# Altium project 4-in-1 ESC based on AM32.PrjPcb
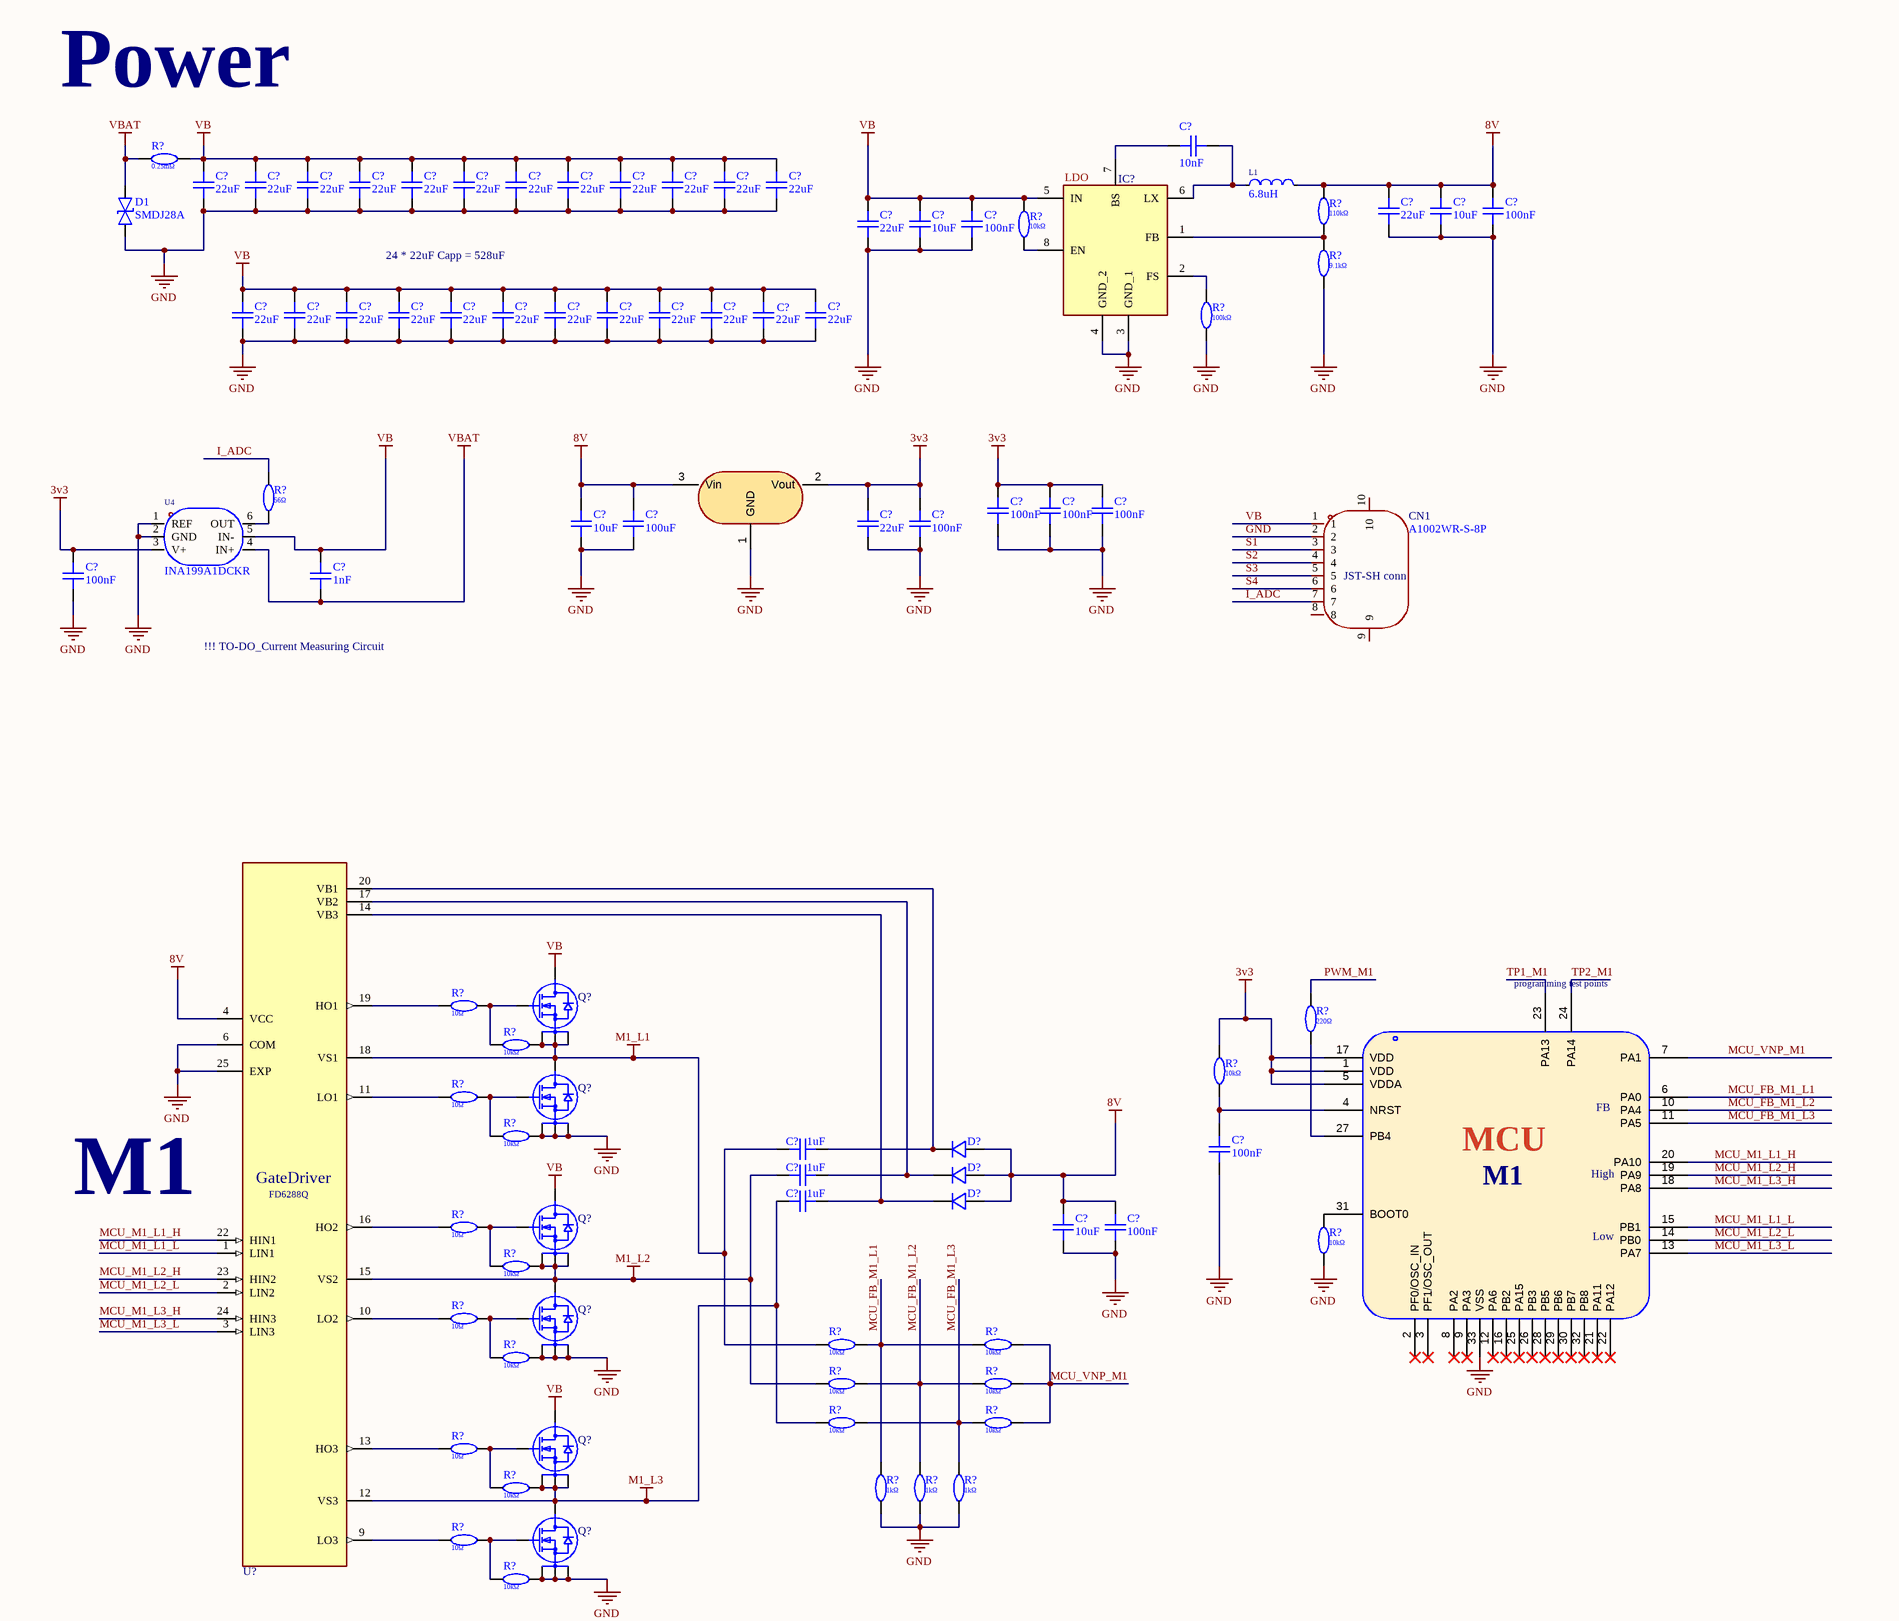
[diagram p0: 4-in-1 ESC based on AM32.SchDoc, top left]
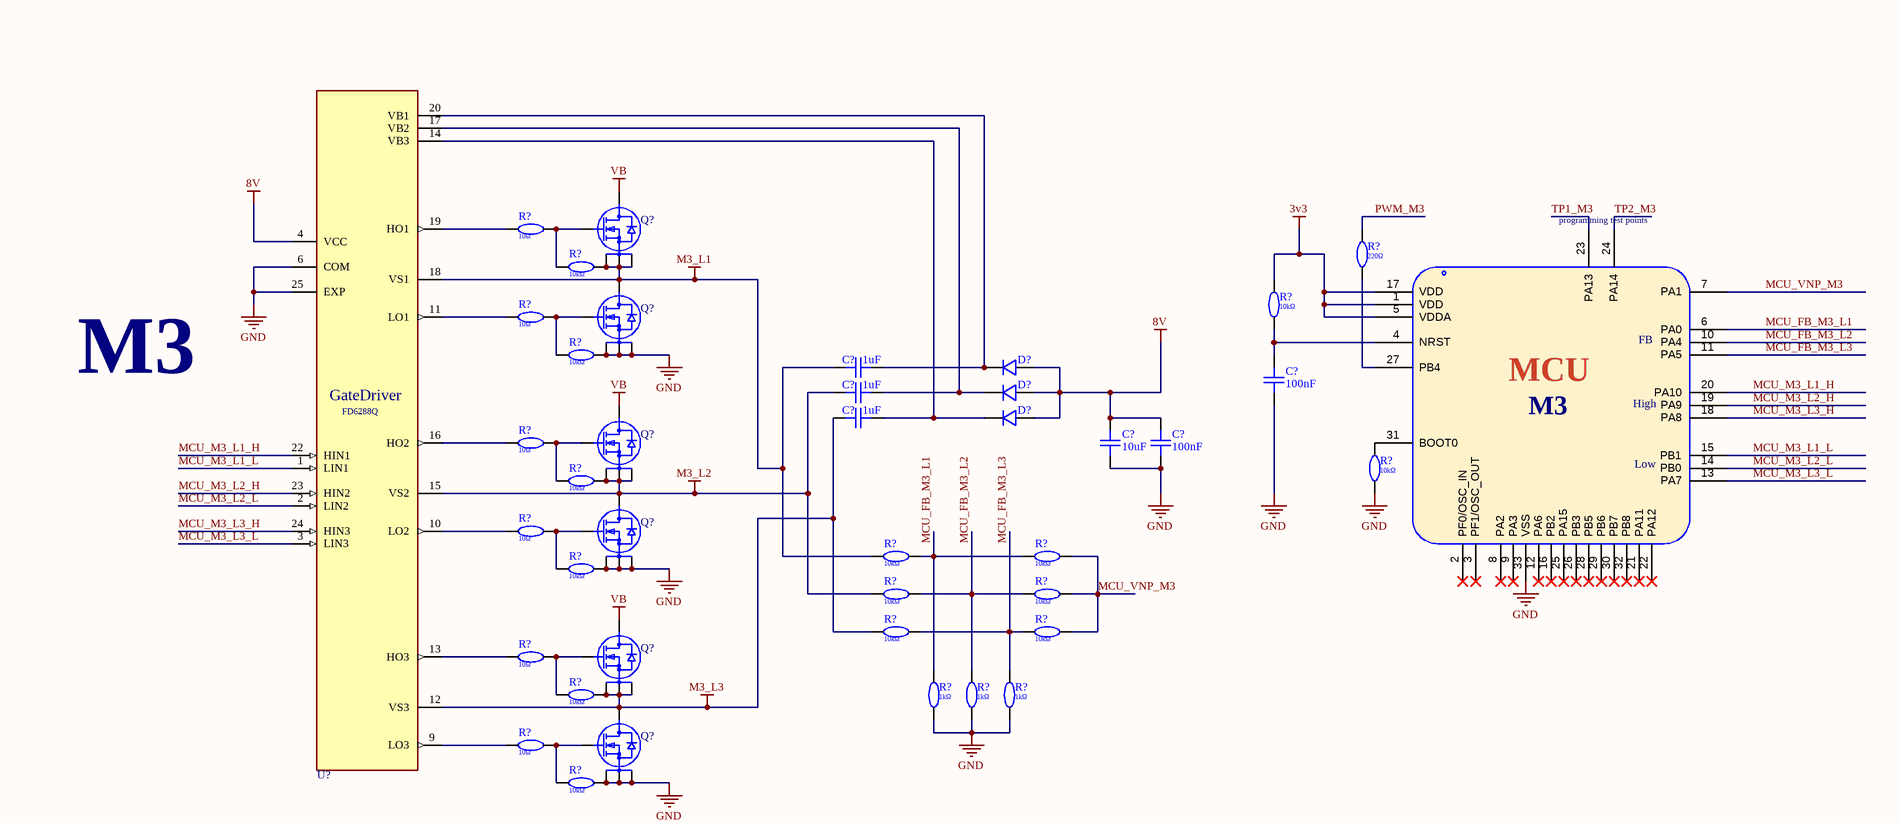
[diagram p1: 4-in-1 ESC based on AM32.SchDoc, top right]
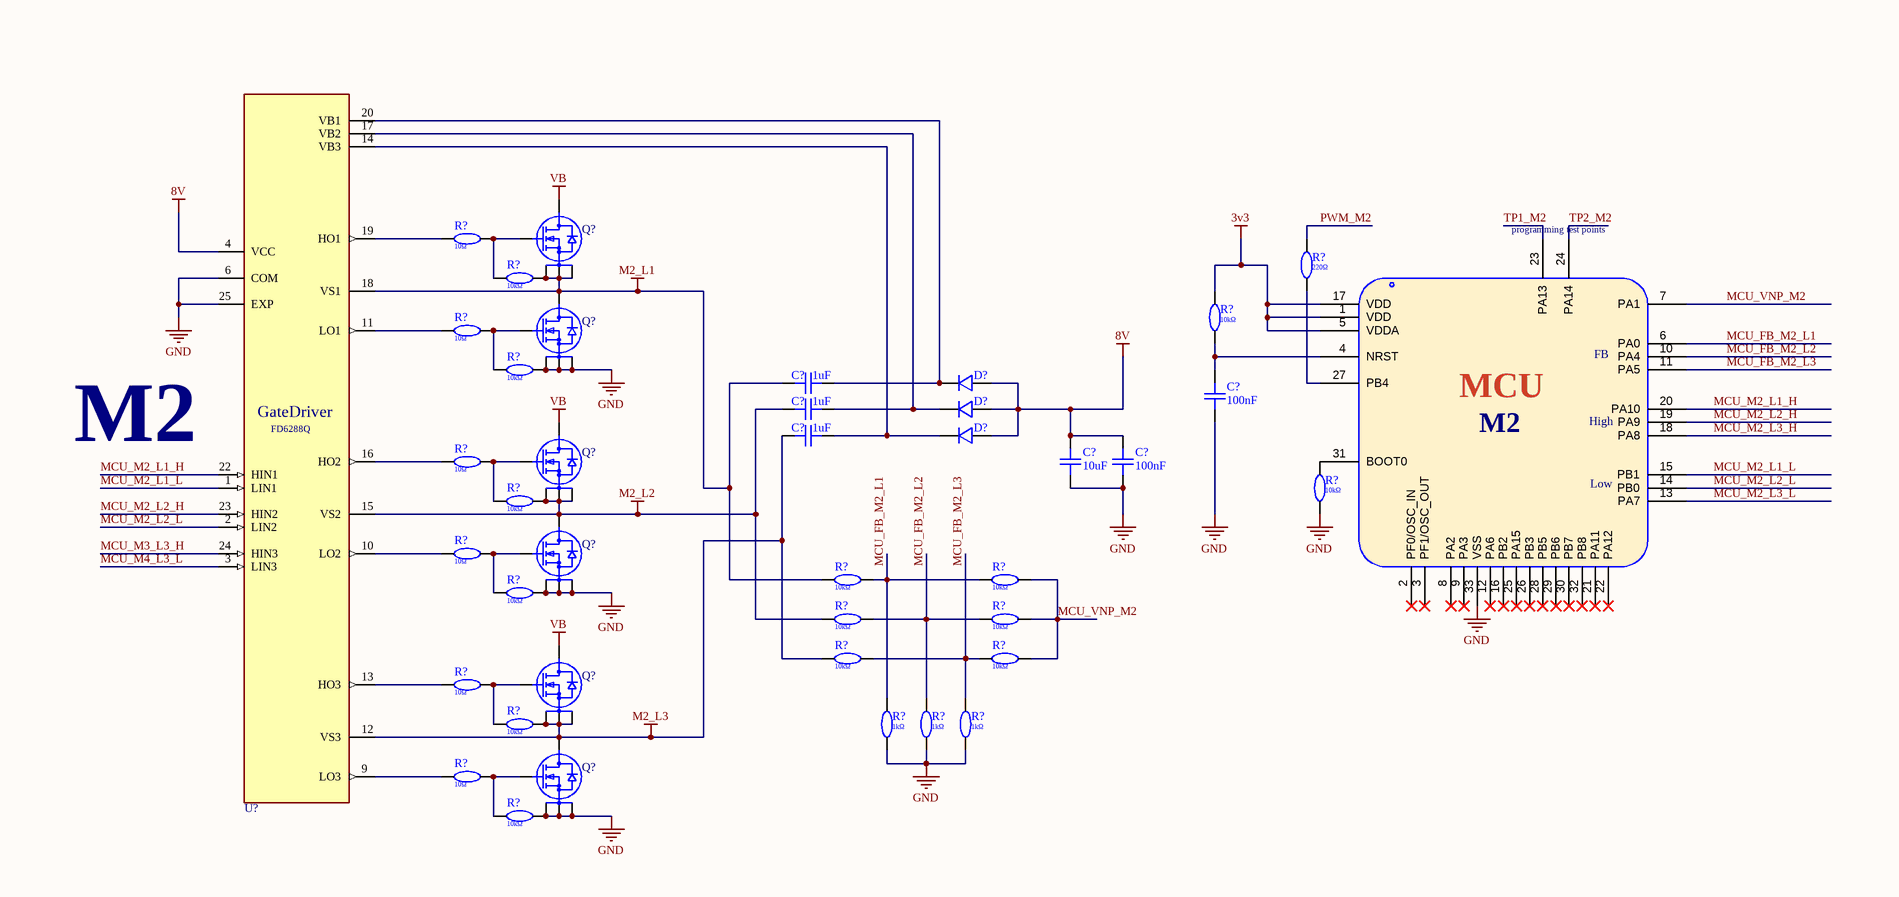
[diagram p2: 4-in-1 ESC based on AM32.SchDoc, bottom left]
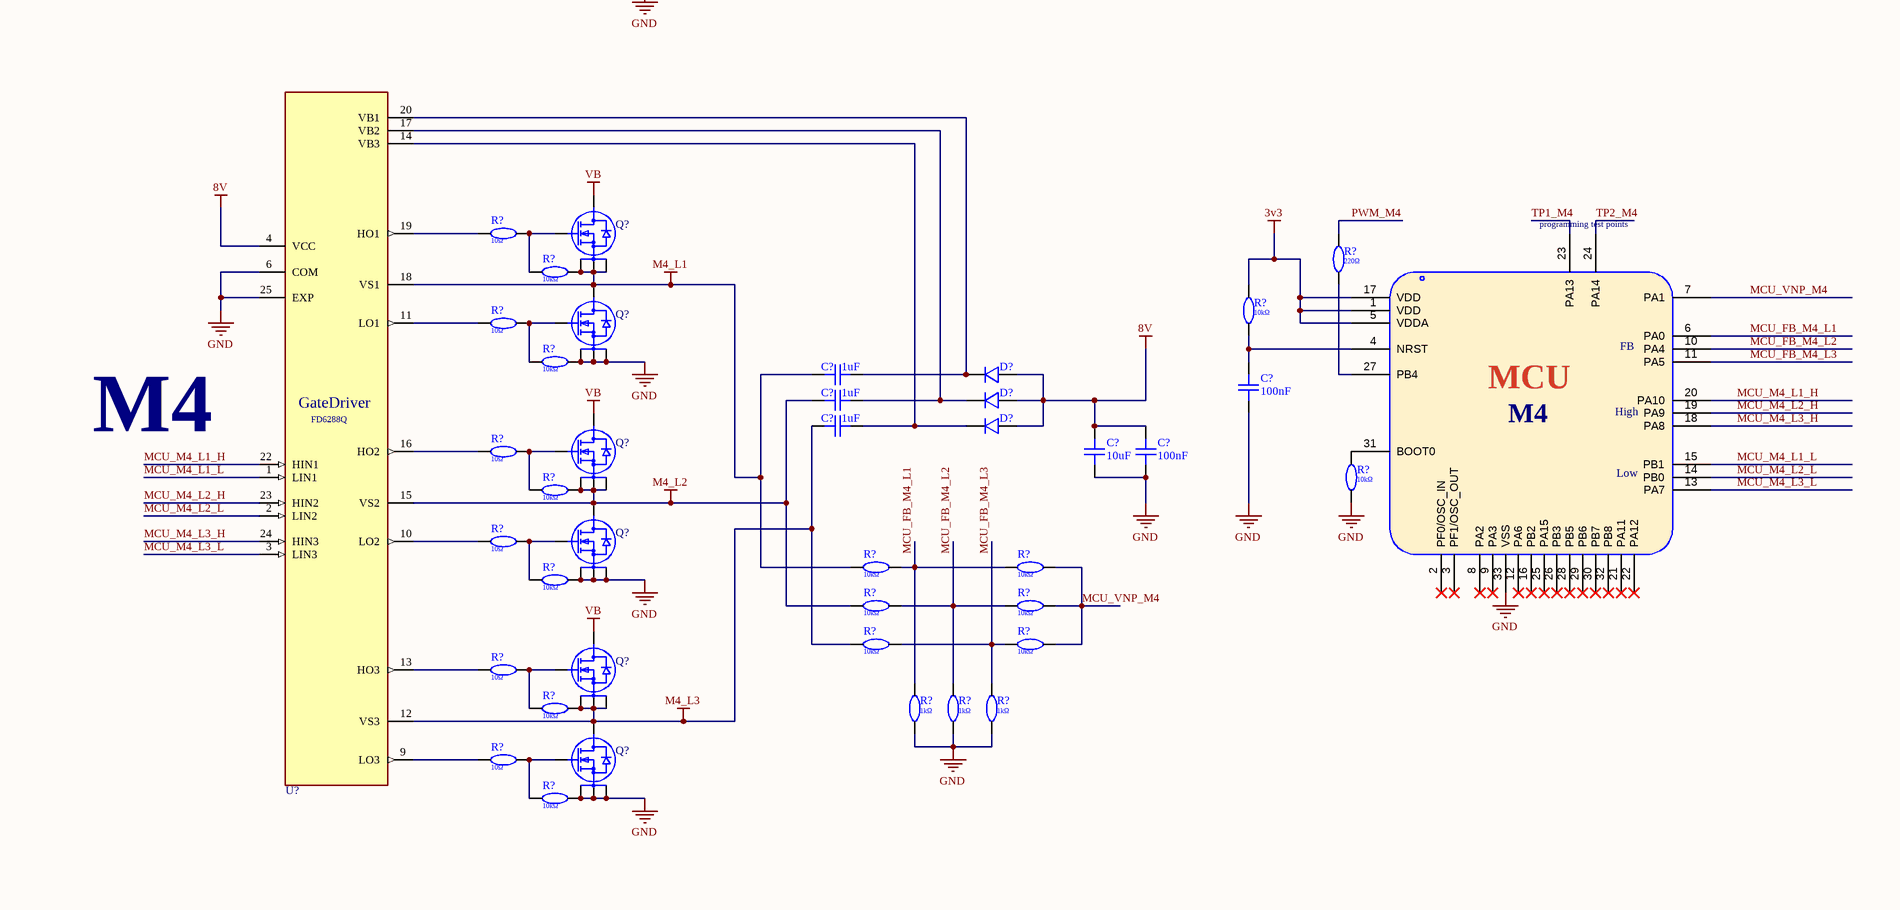
[diagram p3: 4-in-1 ESC based on AM32.SchDoc, bottom right]
1 sheet, 216 parts. Net scope: global (net labels, ports and power ports of the same name join across sheets).
Board file: 4-in-1 ESC based on AM32.PcbDoc

## Sheet 4-in-1 ESC based on AM32.SchDoc
size 812 x 558 mm; SheetNumber: 1; SheetTotal: 1

### Parts
(Parts that share a designator on the sheet are numbered #1, #2 ... from top to bottom, then left to right.)
C?#1  10nF  [C0402]
C?#2  22uF  [C0402]
C?#3  22uF  [C0402]
C?#4  22uF  [C0402]
C?#5  22uF  [C0402]
C?#6  22uF  [C0402]
C?#7  22uF  [C0402]
C?#8  22uF  [C0402]
C?#9  22uF  [C0402]
C?#10  22uF  [C0402]
C?#11  22uF  [C0402]
C?#12  22uF  [C0402]
C?#13  22uF  [C0402]
C?#14  22uF  [C0402]
C?#15  10uF  [C0402]
C?#16  100nF  [C0402]
C?#17  22uF  [C0402]
C?#18  10uF  [C0402]
C?#19  100nF  [C0402]
C?#20  22uF  [C0402]
C?#21  22uF  [C0402]
C?#22  22uF  [C0402]
C?#23  22uF  [C0402]
C?#24  22uF  [C0402]
C?#25  22uF  [C0402]
C?#26  22uF  [C0402]
C?#27  22uF  [C0402]
C?#28  22uF  [C0402]
C?#29  22uF  [C0402]
C?#30  22uF  [C0402]
C?#31  22uF  [C0402]
C?#32  100nF  [C0402]
C?#33  100nF  [C0402]
C?#34  100nF  [C0402]
C?#35  10uF  [C0402]
C?#36  100uF  [C0402]
C?#37  22uF  [C0402]
C?#38  100nF  [C0402]
C?#39  100nF  [C0402]
C?#40  1nF  [C0402]
C?#41  1uF  [C0402]
C?#42  100nF  [C0402]
C?#43  1uF  [C0402]
C?#44  1uF  [C0402]
C?#45  100nF  [C0402]
C?#46  1uF  [C0402]
C?#47  1uF  [C0402]
C?#48  1uF  [C0402]
C?#49  10uF  [C0402]
C?#50  100nF  [C0402]
C?#51  10uF  [C0402]
C?#52  100nF  [C0402]
C?#53  1uF  [C0402]
C?#54  100nF  [C0402]
C?#55  1uF  [C0402]
C?#56  1uF  [C0402]
C?#57  100nF  [C0402]
C?#58  1uF  [C0402]
C?#59  1uF  [C0402]
C?#60  10uF  [C0402]
C?#61  100nF  [C0402]
C?#62  1uF  [C0402]
C?#63  10uF  [C0402]
C?#64  100nF  [C0402]
CN1  A1002WR-S-8P  [CONN-SMD_A1002WR-S-8P]
D1  SMDJ28A  [SMC_L6.9-W5.9-LS7.9-BI]
D?#1  1N4148WTQ-7  [SOD-523_L1.2-W0.8-LS1.6-FD]  (value not drawn)
D?#2  1N4148WTQ-7  [SOD-523_L1.2-W0.8-LS1.6-FD]  (value not drawn)
D?#3  1N4148WTQ-7  [SOD-523_L1.2-W0.8-LS1.6-FD]  (value not drawn)
D?#4  1N4148WTQ-7  [SOD-523_L1.2-W0.8-LS1.6-FD]  (value not drawn)
D?#5  1N4148WTQ-7  [SOD-523_L1.2-W0.8-LS1.6-FD]  (value not drawn)
D?#6  1N4148WTQ-7  [SOD-523_L1.2-W0.8-LS1.6-FD]  (value not drawn)
D?#7  1N4148WTQ-7  [SOD-523_L1.2-W0.8-LS1.6-FD]  (value not drawn)
D?#8  1N4148WTQ-7  [SOD-523_L1.2-W0.8-LS1.6-FD]  (value not drawn)
D?#9  1N4148WTQ-7  [SOD-523_L1.2-W0.8-LS1.6-FD]  (value not drawn)
D?#10  1N4148WTQ-7  [SOD-523_L1.2-W0.8-LS1.6-FD]  (value not drawn)
D?#11  1N4148WTQ-7  [SOD-523_L1.2-W0.8-LS1.6-FD]  (value not drawn)
D?#12  1N4148WTQ-7  [SOD-523_L1.2-W0.8-LS1.6-FD]  (value not drawn)
IC?  LDO_SY8303AIC  [SOT65P280X110-8N]  (value not drawn)
L1  6.8uH  [IND-SMD_L4.4-W4.2]
Q?#1  NTMFS5C430NLT1G  [NRVTS10100EMFST1G]  (value not drawn)
Q?#2  NTMFS5C430NLT1G  [NRVTS10100EMFST1G]  (value not drawn)
Q?#3  NTMFS5C430NLT1G  [NRVTS10100EMFST1G]  (value not drawn)
Q?#4  NTMFS5C430NLT1G  [NRVTS10100EMFST1G]  (value not drawn)
Q?#5  NTMFS5C430NLT1G  [NRVTS10100EMFST1G]  (value not drawn)
Q?#6  NTMFS5C430NLT1G  [NRVTS10100EMFST1G]  (value not drawn)
Q?#7  NTMFS5C430NLT1G  [NRVTS10100EMFST1G]  (value not drawn)
Q?#8  NTMFS5C430NLT1G  [NRVTS10100EMFST1G]  (value not drawn)
Q?#9  NTMFS5C430NLT1G  [NRVTS10100EMFST1G]  (value not drawn)
Q?#10  NTMFS5C430NLT1G  [NRVTS10100EMFST1G]  (value not drawn)
Q?#11  NTMFS5C430NLT1G  [NRVTS10100EMFST1G]  (value not drawn)
Q?#12  NTMFS5C430NLT1G  [NRVTS10100EMFST1G]  (value not drawn)
Q?#13  NTMFS5C430NLT1G  [NRVTS10100EMFST1G]  (value not drawn)
Q?#14  NTMFS5C430NLT1G  [NRVTS10100EMFST1G]  (value not drawn)
Q?#15  NTMFS5C430NLT1G  [NRVTS10100EMFST1G]  (value not drawn)
Q?#16  NTMFS5C430NLT1G  [NRVTS10100EMFST1G]  (value not drawn)
Q?#17  NTMFS5C430NLT1G  [NRVTS10100EMFST1G]  (value not drawn)
Q?#18  NTMFS5C430NLT1G  [NRVTS10100EMFST1G]  (value not drawn)
Q?#19  NTMFS5C430NLT1G  [NRVTS10100EMFST1G]  (value not drawn)
Q?#20  NTMFS5C430NLT1G  [NRVTS10100EMFST1G]  (value not drawn)
Q?#21  NTMFS5C430NLT1G  [NRVTS10100EMFST1G]  (value not drawn)
Q?#22  NTMFS5C430NLT1G  [NRVTS10100EMFST1G]  (value not drawn)
Q?#23  NTMFS5C430NLT1G  [NRVTS10100EMFST1G]  (value not drawn)
Q?#24  NTMFS5C430NLT1G  [NRVTS10100EMFST1G]  (value not drawn)
R?#1  0.25mΩ  [R0402]
R?#2  110kΩ  [R0402]
R?#3  10kΩ  [R0402]
R?#4  9.1kΩ  [R0402]
R?#5  100kΩ  [R0402]
R?#6  56Ω  [R0402]
R?#7  10Ω  [R0402]
R?#8  220Ω  [R0402]
R?#9  10Ω  [R0402]
R?#10  10kΩ  [R0402]
R?#11  220Ω  [R0402]
R?#12  10kΩ  [R0402]
R?#13  10kΩ  [R0402]
R?#14  10Ω  [R0402]
R?#15  10kΩ  [R0402]
R?#16  10Ω  [R0402]
R?#17  10kΩ  [R0402]
R?#18  10kΩ  [R0402]
R?#19  10Ω  [R0402]
R?#20  10kΩ  [R0402]
R?#21  10Ω  [R0402]
R?#22  10kΩ  [R0402]
R?#23  10kΩ  [R0402]
R?#24  10kΩ  [R0402]
R?#25  10Ω  [R0402]
R?#26  10Ω  [R0402]
R?#27  10kΩ  [R0402]
R?#28  10kΩ  [R0402]
R?#29  10kΩ  [R0402]
R?#30  10kΩ  [R0402]
R?#31  10kΩ  [R0402]
R?#32  10kΩ  [R0402]
R?#33  10kΩ  [R0402]
R?#34  10kΩ  [R0402]
R?#35  10kΩ  [R0402]
R?#36  10kΩ  [R0402]
R?#37  10kΩ  [R0402]
R?#38  10kΩ  [R0402]
R?#39  10kΩ  [R0402]
R?#40  10kΩ  [R0402]
R?#41  10Ω  [R0402]
R?#42  10Ω  [R0402]
R?#43  10kΩ  [R0402]
R?#44  1kΩ  [R0402]
R?#45  1kΩ  [R0402]
R?#46  1kΩ  [R0402]
R?#47  10kΩ  [R0402]
R?#48  1kΩ  [R0402]
R?#49  1kΩ  [R0402]
R?#50  1kΩ  [R0402]
R?#51  10Ω  [R0402]
R?#52  10Ω  [R0402]
R?#53  10kΩ  [R0402]
R?#54  10kΩ  [R0402]
R?#55  10Ω  [R0402]
R?#56  220Ω  [R0402]
R?#57  10Ω  [R0402]
R?#58  10kΩ  [R0402]
R?#59  220Ω  [R0402]
R?#60  10kΩ  [R0402]
R?#61  10kΩ  [R0402]
R?#62  10Ω  [R0402]
R?#63  10kΩ  [R0402]
R?#64  10Ω  [R0402]
R?#65  10kΩ  [R0402]
R?#66  10kΩ  [R0402]
R?#67  10Ω  [R0402]
R?#68  10kΩ  [R0402]
R?#69  10Ω  [R0402]
R?#70  10kΩ  [R0402]
R?#71  10kΩ  [R0402]
R?#72  10kΩ  [R0402]
R?#73  10Ω  [R0402]
R?#74  10kΩ  [R0402]
R?#75  10kΩ  [R0402]
R?#76  10Ω  [R0402]
R?#77  10kΩ  [R0402]
R?#78  10kΩ  [R0402]
R?#79  10kΩ  [R0402]
R?#80  10kΩ  [R0402]
R?#81  10kΩ  [R0402]
R?#82  10kΩ  [R0402]
R?#83  10kΩ  [R0402]
R?#84  10kΩ  [R0402]
R?#85  10kΩ  [R0402]
R?#86  10kΩ  [R0402]
R?#87  10Ω  [R0402]
R?#88  10kΩ  [R0402]
R?#89  10kΩ  [R0402]
R?#90  10Ω  [R0402]
R?#91  10kΩ  [R0402]
R?#92  1kΩ  [R0402]
R?#93  1kΩ  [R0402]
R?#94  1kΩ  [R0402]
R?#95  10kΩ  [R0402]
R?#96  1kΩ  [R0402]
R?#97  1kΩ  [R0402]
R?#98  1kΩ  [R0402]
R?#99  10Ω  [R0402]
R?#100  10Ω  [R0402]
R?#101  10kΩ  [R0402]
R?#102  10kΩ  [R0402]
U4  INA199A1DCKR  [SC-70-6_L2.2-W1.3-P0.65-LS2.1-BR]
U?#1  cja1117b-3.3  [SOT-89-3_L4.5-W2.5-P1.50-LS4.2-BR]  (value not drawn)
U?#2  at32f421k8u7  [QFN-32_L5.0-W5.0-P0.50-BL-EP3.4]  (value not drawn)
U?#3  at32f421k8u7  [QFN-32_L5.0-W5.0-P0.50-BL-EP3.4]  (value not drawn)
U?#4  FD6288Q  [QFN50P400X400X90-25N]  (value not drawn)
U?#5  FD6288Q  [QFN50P400X400X90-25N]  (value not drawn)
U?#6  at32f421k8u7  [QFN-32_L5.0-W5.0-P0.50-BL-EP3.4]  (value not drawn)
U?#7  at32f421k8u7  [QFN-32_L5.0-W5.0-P0.50-BL-EP3.4]  (value not drawn)
U?#8  FD6288Q  [QFN50P400X400X90-25N]  (value not drawn)
U?#9  FD6288Q  [QFN50P400X400X90-25N]  (value not drawn)

### Nets
3v3: C?#32.2 C?#33.2 C?#34.2 C?#37.2 C?#38.2 C?#39.2 R?#13.1 R?#15.1 R?#61.1 R?#63.1 U4.3(V+) U?#1.2(Vout) U?#2.1(VDD) U?#2.5(VDDA) U?#2.17(VDD) U?#3.1(VDD) U?#3.5(VDDA) U?#3.17(VDD) U?#6.1(VDD) U?#6.5(VDDA) U?#6.17(VDD) U?#7.1(VDD) U?#7.5(VDDA) U?#7.17(VDD)
8V: C?#14.2 C?#15.2 C?#16.2 C?#35.2 C?#36.2 C?#49.2 C?#50.2 C?#51.2 C?#52.2 C?#60.2 C?#61.2 C?#63.2 C?#64.2 D?#1.1 D?#2.1 D?#3.1 D?#4.1 D?#5.1 D?#6.1 D?#7.1 D?#8.1 D?#9.1 D?#10.1 D?#11.1 D?#12.1 L1.2 R?#2.1 U?#1.3(Vin) U?#4.4(VCC) U?#5.4(VCC) U?#8.4(VCC) U?#9.4(VCC)
GND: C?#2.1 C?#3.1 C?#4.1 C?#5.1 C?#6.1 C?#7.1 C?#8.1 C?#9.1 C?#10.1 C?#11.1 C?#12.1 C?#13.1 C?#14.1 C?#15.1 C?#16.1 C?#17.1 C?#18.1 C?#19.1 C?#20.1 C?#21.1 C?#22.1 C?#23.1 C?#24.1 C?#25.1 C?#26.1 C?#27.1 C?#28.1 C?#29.1 C?#30.1 C?#31.1 C?#32.1 C?#33.1 C?#34.1 C?#35.1 C?#36.1 C?#37.1 C?#38.1 C?#39.1 C?#42.1 C?#45.1 C?#49.1 C?#50.1 C?#51.1 C?#52.1 C?#54.1 C?#57.1 C?#60.1 C?#61.1 C?#63.1 C?#64.1 CN1.2 D1.1 IC?.3(GND_1) IC?.4(GND_2) Q?#3.1(S_1) Q?#3.2(S_2) Q?#3.3(S_3) Q?#4.1(S_1) Q?#4.2(S_2) Q?#4.3(S_3) Q?#7.1(S_1) Q?#7.2(S_2) Q?#7.3(S_3) Q?#8.1(S_1) Q?#8.2(S_2) Q?#8.3(S_3) Q?#11.1(S_1) Q?#11.2(S_2) Q?#11.3(S_3) Q?#12.1(S_1) Q?#12.2(S_2) Q?#12.3(S_3) Q?#15.1(S_1) Q?#15.2(S_2) Q?#15.3(S_3) Q?#16.1(S_1) Q?#16.2(S_2) Q?#16.3(S_3) Q?#19.1(S_1) Q?#19.2(S_2) Q?#19.3(S_3) Q?#20.1(S_1) Q?#20.2(S_2) Q?#20.3(S_3) Q?#23.1(S_1) Q?#23.2(S_2) Q?#23.3(S_3) Q?#24.1(S_1) Q?#24.2(S_2) Q?#24.3(S_3) R?#4.2 R?#5.2 R?#17.1 R?#18.1 R?#20.1 R?#23.1 R?#29.1 R?#32.1 R?#44.2 R?#45.2 R?#46.2 R?#48.2 R?#49.2 R?#50.2 R?#53.1 R?#54.1 R?#65.1 R?#66.1 R?#68.1 R?#71.1 R?#77.1 R?#82.1 R?#92.2 R?#93.2 R?#94.2 R?#96.2 R?#97.2 R?#98.2 R?#101.1 R?#102.1 U4.1(REF) U4.2(GND) U?#1.1(GND) U?#2.33(VSS) U?#3.33(VSS) U?#4.6(COM) U?#4.25(EXP) U?#5.6(COM) U?#5.25(EXP) U?#6.33(VSS) U?#7.33(VSS) U?#8.6(COM) U?#8.25(EXP) U?#9.6(COM) U?#9.25(EXP)
M1_L1: C?#41.1 Q?#1.1(S_1) Q?#1.2(S_2) Q?#1.3(S_3) Q?#3.5(D) R?#10.1 R?#27.2 U?#4.18(VS1)
M1_L2: C?#44.1 Q?#5.1(S_1) Q?#5.2(S_2) Q?#5.3(S_3) Q?#7.5(D) R?#22.1 R?#33.2 U?#4.15(VS2)
M1_L3: C?#47.1 Q?#9.1(S_1) Q?#9.2(S_2) Q?#9.3(S_3) Q?#11.5(D) R?#37.2 R?#43.1 U?#4.12(VS3)
M2_L1: C?#56.1 Q?#14.1(S_1) Q?#14.2(S_2) Q?#14.3(S_3) Q?#16.5(D) R?#60.1 R?#78.2 U?#9.18(VS1)
M2_L2: C?#59.1 Q?#18.1(S_1) Q?#18.2(S_2) Q?#18.3(S_3) Q?#20.5(D) R?#72.1 R?#83.2 U?#9.15(VS2)
M2_L3: C?#62.1 Q?#22.1(S_1) Q?#22.2(S_2) Q?#22.3(S_3) Q?#24.5(D) R?#88.2 R?#95.1 U?#9.12(VS3)
M3_L1: C?#43.1 Q?#2.1(S_1) Q?#2.2(S_2) Q?#2.3(S_3) Q?#4.5(D) R?#12.1 R?#30.2 U?#5.18(VS1)
M3_L2: C?#46.1 Q?#6.1(S_1) Q?#6.2(S_2) Q?#6.3(S_3) Q?#8.5(D) R?#24.1 R?#35.2 U?#5.15(VS2)
M3_L3: C?#48.1 Q?#10.1(S_1) Q?#10.2(S_2) Q?#10.3(S_3) Q?#12.5(D) R?#39.2 R?#47.1 U?#5.12(VS3)
M4_L1: C?#53.1 Q?#13.1(S_1) Q?#13.2(S_2) Q?#13.3(S_3) Q?#15.5(D) R?#58.1 R?#74.2 U?#8.18(VS1)
M4_L2: C?#55.1 Q?#17.1(S_1) Q?#17.2(S_2) Q?#17.3(S_3) Q?#19.5(D) R?#70.1 R?#80.2 U?#8.15(VS2)
M4_L3: C?#58.1 Q?#21.1(S_1) Q?#21.2(S_2) Q?#21.3(S_3) Q?#23.5(D) R?#85.2 R?#91.1 U?#8.12(VS3)
VB: C?#2.2 C?#3.2 C?#4.2 C?#5.2 C?#6.2 C?#7.2 C?#8.2 C?#9.2 C?#10.2 C?#11.2 C?#12.2 C?#13.2 C?#17.2 C?#18.2 C?#19.2 C?#20.2 C?#21.2 C?#22.2 C?#23.2 C?#24.2 C?#25.2 C?#26.2 C?#27.2 C?#28.2 C?#29.2 C?#30.2 C?#31.2 C?#40.2 CN1.1 IC?.5(IN) Q?#1.5(D) Q?#2.5(D) Q?#5.5(D) Q?#6.5(D) Q?#9.5(D) Q?#10.5(D) Q?#13.5(D) Q?#14.5(D) Q?#17.5(D) Q?#18.5(D) Q?#21.5(D) Q?#22.5(D) R?#1.1 R?#3.1 U4.5(IN-)
VBAT: C?#40.1 D1.2 R?#1.2 U4.4(IN+)
I_ADC: CN1.7 R?#6.1
MCU_FB_M1_L1: R?#27.1 R?#28.2 R?#44.1 U?#2.6(PA0)
MCU_FB_M1_L2: R?#33.1 R?#34.2 R?#45.1 U?#2.10(PA4)
MCU_FB_M1_L3: R?#37.1 R?#38.2 R?#46.1 U?#2.11(PA5)
MCU_FB_M2_L1: R?#78.1 R?#79.2 R?#96.1 U?#7.6(PA0)
MCU_FB_M2_L2: R?#83.1 R?#84.2 R?#97.1 U?#7.10(PA4)
MCU_FB_M2_L3: R?#88.1 R?#89.2 R?#98.1 U?#7.11(PA5)
MCU_FB_M3_L1: R?#30.1 R?#31.2 R?#48.1 U?#3.6(PA0)
MCU_FB_M3_L2: R?#35.1 R?#36.2 R?#49.1 U?#3.10(PA4)
MCU_FB_M3_L3: R?#39.1 R?#40.2 R?#50.1 U?#3.11(PA5)
MCU_FB_M4_L1: R?#74.1 R?#75.2 R?#92.1 U?#6.6(PA0)
MCU_FB_M4_L2: R?#80.1 R?#81.2 R?#93.1 U?#6.10(PA4)
MCU_FB_M4_L3: R?#85.1 R?#86.2 R?#94.1 U?#6.11(PA5)
MCU_M1_L1_H: U?#2.20(PA10) U?#4.22(HIN1)
MCU_M1_L1_L: U?#2.15(PB1) U?#4.1(LIN1)
MCU_M1_L2_H: U?#2.19(PA9) U?#4.23(HIN2)
MCU_M1_L2_L: U?#2.14(PB0) U?#4.2(LIN2)
MCU_M1_L3_H: U?#2.18(PA8) U?#4.24(HIN3)
MCU_M1_L3_L: U?#2.13(PA7) U?#4.3(LIN3)
MCU_M2_L1_H: U?#7.20(PA10) U?#9.22(HIN1)
MCU_M2_L1_L: U?#7.15(PB1) U?#9.1(LIN1)
MCU_M2_L2_H: U?#7.19(PA9) U?#9.23(HIN2)
MCU_M2_L2_L: U?#7.14(PB0) U?#9.2(LIN2)
MCU_M2_L3_H: U?#7.18(PA8)
MCU_M2_L3_L: U?#7.13(PA7)
MCU_M3_L1_H: U?#3.20(PA10) U?#5.22(HIN1)
MCU_M3_L1_L: U?#3.15(PB1) U?#5.1(LIN1)
MCU_M3_L2_H: U?#3.19(PA9) U?#5.23(HIN2)
MCU_M3_L2_L: U?#3.14(PB0) U?#5.2(LIN2)
MCU_M3_L3_H: U?#3.18(PA8) U?#5.24(HIN3) U?#9.24(HIN3)
MCU_M3_L3_L: U?#3.13(PA7) U?#5.3(LIN3)
MCU_M4_L1_H: U?#6.20(PA10) U?#8.22(HIN1)
MCU_M4_L1_L: U?#6.15(PB1) U?#8.1(LIN1)
MCU_M4_L2_H: U?#6.19(PA9) U?#8.23(HIN2)
MCU_M4_L2_L: U?#6.14(PB0) U?#8.2(LIN2)
MCU_M4_L3_H: U?#6.18(PA8) U?#8.24(HIN3)
MCU_M4_L3_L: U?#6.13(PA7) U?#8.3(LIN3) U?#9.3(LIN3)
MCU_VNP_M1: R?#28.1 R?#34.1 R?#38.1 U?#2.7(PA1)
MCU_VNP_M2: R?#79.1 R?#84.1 R?#89.1 U?#7.7(PA1)
MCU_VNP_M3: R?#31.1 R?#36.1 R?#40.1 U?#3.7(PA1)
MCU_VNP_M4: R?#75.1 R?#81.1 R?#86.1 U?#6.7(PA1)
PWM_M1: R?#8.1
PWM_M2: R?#59.1
PWM_M3: R?#11.1
PWM_M4: R?#56.1
S1: CN1.3
S2: CN1.4
S3: CN1.5
S4: CN1.6
TP1_M1: U?#2.23(PA13)
TP1_M2: U?#7.23(PA13)
TP1_M3: U?#3.23(PA13)
TP1_M4: U?#6.23(PA13)
TP2_M1: U?#2.24(PA14)
TP2_M2: U?#7.24(PA14)
TP2_M3: U?#3.24(PA14)
TP2_M4: U?#6.24(PA14)
NetC?#1_1: C?#1.1 IC?.7(BS)
NetC?#1_2: C?#1.2 IC?.6(LX) L1.1
NetC?#41_2: C?#41.2 D?#1.2 U?#4.20(VB1)
NetC?#42_2: C?#42.2 R?#13.2 U?#2.4(NRST)
NetC?#43_2: C?#43.2 D?#2.2 U?#5.20(VB1)
NetC?#44_2: C?#44.2 D?#3.2 U?#4.17(VB2)
NetC?#45_2: C?#45.2 R?#15.2 U?#3.4(NRST)
NetC?#46_2: C?#46.2 D?#4.2 U?#5.17(VB2)
NetC?#47_2: C?#47.2 D?#5.2 U?#4.14(VB3)
NetC?#48_2: C?#48.2 D?#6.2 U?#5.14(VB3)
NetC?#53_2: C?#53.2 D?#7.2 U?#8.20(VB1)
NetC?#54_2: C?#54.2 R?#61.2 U?#6.4(NRST)
NetC?#55_2: C?#55.2 D?#8.2 U?#8.17(VB2)
NetC?#56_2: C?#56.2 D?#9.2 U?#9.20(VB1)
NetC?#57_2: C?#57.2 R?#63.2 U?#7.4(NRST)
NetC?#58_2: C?#58.2 D?#10.2 U?#8.14(VB3)
NetC?#59_2: C?#59.2 D?#11.2 U?#9.17(VB2)
NetC?#62_2: C?#62.2 D?#12.2 U?#9.14(VB3)
NetIC?_1: IC?.1(FB) R?#2.2 R?#4.1
NetIC?_2: IC?.2(FS) R?#5.1
NetIC?_8: IC?.8(EN) R?#3.2
NetQ?#1_4: Q?#1.4(G) R?#7.1 R?#10.2
NetQ?#2_4: Q?#2.4(G) R?#9.1 R?#12.2
NetQ?#3_4: Q?#3.4(G) R?#14.1 R?#17.2
NetQ?#4_4: Q?#4.4(G) R?#16.1 R?#18.2
NetQ?#5_4: Q?#5.4(G) R?#19.1 R?#22.2
NetQ?#6_4: Q?#6.4(G) R?#21.1 R?#24.2
NetQ?#7_4: Q?#7.4(G) R?#25.1 R?#29.2
NetQ?#8_4: Q?#8.4(G) R?#26.1 R?#32.2
NetQ?#9_4: Q?#9.4(G) R?#41.1 R?#43.2
NetQ?#10_4: Q?#10.4(G) R?#42.1 R?#47.2
NetQ?#11_4: Q?#11.4(G) R?#51.1 R?#53.2
NetQ?#12_4: Q?#12.4(G) R?#52.1 R?#54.2
NetQ?#13_4: Q?#13.4(G) R?#55.1 R?#58.2
NetQ?#14_4: Q?#14.4(G) R?#57.1 R?#60.2
NetQ?#15_4: Q?#15.4(G) R?#62.1 R?#65.2
NetQ?#16_4: Q?#16.4(G) R?#64.1 R?#66.2
NetQ?#17_4: Q?#17.4(G) R?#67.1 R?#70.2
NetQ?#18_4: Q?#18.4(G) R?#69.1 R?#72.2
NetQ?#19_4: Q?#19.4(G) R?#73.1 R?#77.2
NetQ?#20_4: Q?#20.4(G) R?#76.1 R?#82.2
NetQ?#21_4: Q?#21.4(G) R?#87.1 R?#91.2
NetQ?#22_4: Q?#22.4(G) R?#90.1 R?#95.2
NetQ?#23_4: Q?#23.4(G) R?#99.1 R?#101.2
NetQ?#24_4: Q?#24.4(G) R?#100.1 R?#102.2
NetR?#6_2: R?#6.2 U4.6(OUT)
NetR?#7_2: R?#7.2 U?#4.19(HO1)
NetR?#8_2: R?#8.2 U?#2.27(PB4)
NetR?#9_2: R?#9.2 U?#5.19(HO1)
NetR?#11_2: R?#11.2 U?#3.27(PB4)
NetR?#14_2: R?#14.2 U?#4.11(LO1)
NetR?#16_2: R?#16.2 U?#5.11(LO1)
NetR?#19_2: R?#19.2 U?#4.16(HO2)
NetR?#20_2: R?#20.2 U?#2.31(BOOT0)
NetR?#21_2: R?#21.2 U?#5.16(HO2)
NetR?#23_2: R?#23.2 U?#3.31(BOOT0)
NetR?#25_2: R?#25.2 U?#4.10(LO2)
NetR?#26_2: R?#26.2 U?#5.10(LO2)
NetR?#41_2: R?#41.2 U?#4.13(HO3)
NetR?#42_2: R?#42.2 U?#5.13(HO3)
NetR?#51_2: R?#51.2 U?#4.9(LO3)
NetR?#52_2: R?#52.2 U?#5.9(LO3)
NetR?#55_2: R?#55.2 U?#8.19(HO1)
NetR?#56_2: R?#56.2 U?#6.27(PB4)
NetR?#57_2: R?#57.2 U?#9.19(HO1)
NetR?#59_2: R?#59.2 U?#7.27(PB4)
NetR?#62_2: R?#62.2 U?#8.11(LO1)
NetR?#64_2: R?#64.2 U?#9.11(LO1)
NetR?#67_2: R?#67.2 U?#8.16(HO2)
NetR?#68_2: R?#68.2 U?#6.31(BOOT0)
NetR?#69_2: R?#69.2 U?#9.16(HO2)
NetR?#71_2: R?#71.2 U?#7.31(BOOT0)
NetR?#73_2: R?#73.2 U?#8.10(LO2)
NetR?#76_2: R?#76.2 U?#9.10(LO2)
NetR?#87_2: R?#87.2 U?#8.13(HO3)
NetR?#90_2: R?#90.2 U?#9.13(HO3)
NetR?#99_2: R?#99.2 U?#8.9(LO3)
NetR?#100_2: R?#100.2 U?#9.9(LO3)

Not connected (* = marked no-connect by the designer): CN1 8 9 10; U?#2 2(PF0/OSC_IN)* 3(PF1/OSC_OUT)* 8(PA2)* 9(PA3)* 12(PA6)* 16(PB2)* 21(PA11)* 22(PA12)* 25(PA15)* 26(PB3)* 28(PB5)* 29(PB6)* 30(PB7)* 32(PB8)*; U?#3 2(PF0/OSC_IN)* 3(PF1/OSC_OUT)* 8(PA2)* 9(PA3)* 12(PA6)* 16(PB2)* 21(PA11)* 22(PA12)* 25(PA15)* 26(PB3)* 28(PB5)* 29(PB6)* 30(PB7)* 32(PB8)*; U?#6 2(PF0/OSC_IN)* 3(PF1/OSC_OUT)* 8(PA2)* 9(PA3)* 12(PA6)* 16(PB2)* 21(PA11)* 22(PA12)* 25(PA15)* 26(PB3)* 28(PB5)* 29(PB6)* 30(PB7)* 32(PB8)*; U?#7 2(PF0/OSC_IN)* 3(PF1/OSC_OUT)* 8(PA2)* 9(PA3)* 12(PA6)* 16(PB2)* 21(PA11)* 22(PA12)* 25(PA15)* 26(PB3)* 28(PB5)* 29(PB6)* 30(PB7)* 32(PB8)*

### Notes on the sheet
- Power
- (near C?#23) 24 * 22uF Capp = 528uF
- !!! TO-DO_Current Measuring Circuit
- (near U?#2) programming test points
- (near U?#3) programming test points
- M1
- (near U?#2) M1
- M3
- (near U?#3) M3
- (near U?#6) programming test points
- (near U?#7) programming test points
- (near U?#7) M2
- M4
- (near U?#6) M4
- M2
- (in symbol CONN_A1002WR-S-8P) JST-SH conn
- (in symbol LDO_SY8303AIC) LDO
- (in symbol MCU_at32f421k8u7) FB; MCU; High; Low

### Library data of the parts
C?#1-C?#40 C?#42 C?#45 C?#49-C?#52 C?#54 C?#57 C?#60 C?#61 C?#63 C?#64 = CAP_0402_1: Symbol: CapAcitance; Convert to PCB: yes; Value: 1uF; Device: CAP_0402; Add into BOM: yes; Supplier Footprint: 0402; Supplier Part: C1518208
C?#41 C?#43 C?#44 C?#46-C?#48 C?#53 C?#55 C?#56 C?#58 C?#59 C?#62 = CAP_0402_1: Symbol: CapAcitance; Convert to PCB: yes; Device: CAP_0402; Add into BOM: yes; Supplier Footprint: 0402; Value: 1uF; Supplier Part: C1518208
CN1 = CONN_A1002WR-S-8P: Manufacturer: CJT(长江连接器); Add into BOM: yes; Connector Type: 接头; Pitch: 0.039quot;(1.00mm); Number of Positions: 8; Symbol: A1002WR-S-8P; Device: A1002WR-S-8P; LCSC Part Name: 8P,脚距1mm; Supplier Part: C239526; Manufacturer Part: A1002WR-S-8P; Supplier Footprint: SMD,P=1mm; JLCPCB Part Class: 扩展库; Datasheet: https://atta.szlcsc.com/upload/public/pdf/watermark/20190926/C239526_E6EB898D74B3D7AFB647860A542281E4.pdf; Supplier: LCSC; Convert to PCB: yes; Series: SH; Contact Type: 公形引脚; Number of Rows: 1; Row Spacing: -; Mounting Type: 表面贴装; Contact Material: 磷青铜
D1 = TVS_SMDJ40CA_C2842374: Manufacturer: BORN(伯恩半导体); Add into BOM: yes; Polarity: 双向; Reverse Stand-Off Voltage (Vrwm): 40V; Breakdown Voltage: 44.4V; Reverse Leakage Current (Ir): 1uA; Peak Pulse Current (Ipp)@10/1000μs: 46.5A; Maximum Clamping Voltage: 64.5V; Symbol: SMDJ40CA_C2842374; Device: SMDJ40CA_C2842374; LCSC Part Name: 双向 Vrwm:40V; Supplier Part: C2842374; Manufacturer Part: SMDJ40CA; Supplier Footprint: DO-214AB; JLCPCB Part Class: 扩展库; Datasheet: https://atta.szlcsc.com/upload/public/pdf/source/20200413/C152077_2BEB0A19CF219C0016744A470088E912.pdf; Supplier: LCSC; Convert to PCB: yes
D?#1-D?#12 = DIODE_1N4148WTQ-7: Manufacturer: DIODES(美台); Add into BOM: yes; Symbol: 1N4148WTQ-7; Device: 1N4148WTQ-7; LCSC Part Name: 1N4148WTQ-7; Supplier Part: C526201; Manufacturer Part: 1N4148WTQ-7; Supplier Footprint: SOD-523; JLCPCB Part Class: 扩展库; Datasheet: https://atta.szlcsc.com/upload/public/pdf/source/20190514/C260881_066AD27E33D2A47997C794E9A492FC20.pdf; Supplier: LCSC; Convert to PCB: yes
IC? = LDO_SY8303AIC: Integrated Circuit; Manufacturer_Name: Silergy; Datasheet Link: https://datasheet.lcsc.com/szlcsc/Silergy-Corp-SY8303AIC_C97054.pdf; Height: 1.1mm; Manufacturer_Part_Number: SY8303AIC
L1 = L_FXL0420-6R8-M: Manufacturer: cjiang(长江微电); Add into BOM: yes; Tolerance: ±20%; Rated Current: 2.4A; Saturation Current (Isat): 2.5A; DC Resistance (DCR): 160mΩ; Symbol: FXL0420-6R8-M; Device: FXL0420-6R8-M; Supplier: LCSC; Supplier Part: C177241; Manufacturer Part: FXL0420-6R8-M; Value: 6.8uH; JLCPCB Part Class: 扩展库; LCSC Part Name: 6.8uH ±20% 2.5A; Supplier Footprint: SMD,4.2x4.4mm; Datasheet: https://atta.szlcsc.com/upload/public/pdf/source/20190322/C177241_926E0DC8333CBC0DC90F3B0802D0087D.pdf; Convert to PCB: yes
Q?#1-Q?#24 = Mosfet: MOSFET (N-Channel); Manufacturer_Name: onsemi; Datasheet Link: https://www.onsemi.com/pub/Collateral/NTMFS5C430NL-D.PDF; Manufacturer_Part_Number: NTMFS5C430NLT1G; Mouser Part Number: 863-NTMFS5C430NLT1G; Mouser Price/Stock: https://www.mouser.co.uk/ProductDetail/onsemi/NTMFS5C430NLT1G?qs=raqtESnDWsBgV0Rq1XpCKg%3D%3D; Arrow Part Number: NTMFS5C430NLT1G; Arrow Price/Stock: https://www.arrow.com/en/products/ntmfs5c430nlt1g/on-semiconductor?utm_currency=USD&region=nac
R?#1-R?#6 R?#8 R?#11 R?#13 R?#15 R?#20 R?#23 R?#27 R?#28 R?#30 R?#31 R?#33-R?#40 R?#44-R?#46 R?#48-R?#50 R?#56 R?#59 R?#61 R?#63 R?#68 R?#71 R?#74 R?#75 R?#78-R?#81 R?#83-R?#86 R?#88 R?#89 R?#92-R?#94 R?#96-R?#98 = R_ERJ2RKF10R0X: Manufacturer: PANASONIC(松下); Symbol: 电阻; Add into BOM: yes; Tolerance: ±1%; Power(Watts): 100mW; Temperature Coefficient: ±100ppm/℃; Value: 10Ω; Device: ERJ2RKF10R0X; LCSC Part Name: 10Ω ±1% 100mW 厚膜电阻; Supplier Part: C413044; Manufacturer Part: ERJ2RKF10R0X; Supplier Footprint: 0402; JLCPCB Part Class: Extended Part; Datasheet: https://atta.szlcsc.com/upload/public/pdf/source/20190820/C413044_F4750BFC0D010E0807409DDD598E5114.pdf; Supplier: LCSC; Convert to PCB: yes; Overload Voltage (Max): -; Type: 厚膜电阻; Operating Temperature Range: -55℃~+155℃
R?#7 R?#9 R?#14 R?#16 R?#19 R?#21 R?#25 R?#26 R?#41 R?#42 R?#51 R?#52 R?#55 R?#57 R?#62 R?#64 R?#67 R?#69 R?#73 R?#76 R?#87 R?#90 R?#99 R?#100 = R_ERJ2RKF10R0X: Manufacturer: PANASONIC(松下); Symbol: 电阻; Add into BOM: yes; Tolerance: ±1%; Power(Watts): 100mW; Temperature Coefficient: ±100ppm/℃; Device: ERJ2RKF10R0X; LCSC Part Name: 10Ω ±1% 100mW 厚膜电阻; Supplier Part: C413044; Manufacturer Part: ERJ2RKF10R0X; Supplier Footprint: 0402; JLCPCB Part Class: Extended Part; Datasheet: https://atta.szlcsc.com/upload/public/pdf/source/20190820/C413044_F4750BFC0D010E0807409DDD598E5114.pdf; Supplier: LCSC; Convert to PCB: yes; Value: 10Ω; Overload Voltage (Max): -; Type: 厚膜电阻; Operating Temperature Range: -55℃~+155℃
R?#10 R?#12 R?#17 R?#18 R?#22 R?#24 R?#29 R?#32 R?#43 R?#47 R?#53 R?#54 R?#58 R?#60 R?#65 R?#66 R?#70 R?#72 R?#77 R?#82 R?#91 R?#95 R?#101 R?#102 = R_ERJ2RKF10R0X: Manufacturer: PANASONIC(松下); Symbol: 电阻; Add into BOM: yes; Value: 10Ω; Tolerance: ±1%; Power(Watts): 100mW; Temperature Coefficient: ±100ppm/℃; Device: ERJ2RKF10R0X; LCSC Part Name: 10Ω ±1% 100mW 厚膜电阻; Supplier Part: C413044; Manufacturer Part: ERJ2RKF10R0X; Supplier Footprint: 0402; JLCPCB Part Class: Extended Part; Datasheet: https://atta.szlcsc.com/upload/public/pdf/source/20190820/C413044_F4750BFC0D010E0807409DDD598E5114.pdf; Supplier: LCSC; Convert to PCB: yes; Overload Voltage (Max): -; Type: 厚膜电阻; Operating Temperature Range: -55℃~+155℃
U4 = Imeasured_INA199A1DCKR: Manufacturer: TI(德州仪器); Add into BOM: yes; Supply Current: 300uA; Supply Voltage: -300mV~26V; Symbol: INA199A1DCKR; Device: INA199A1DCKR; Supplier: LCSC; Manufacturer Part: INA199A1DCKR; Supplier Part: C59135; JLCPCB Part Class: 扩展库; LCSC Part Name: INA199A1DCKR; Supplier Footprint: SOT-323-6; Datasheet: https://www.ti.com/cn/lit/gpn/ina199; Convert to PCB: yes; Operating Temperature: -40℃~+125℃
U?#1 = Vreg_cja1117b-3.3: Output Configuration:Positive Voltage - Supply:15V Output Voltage:3.3V Output Voltage:3.3V Output Current:1A Power Supply Rejection Ratio (PSRR):75dB@(120Hz) Voltage Dropout:1.15V@(1A) standby current:5mA Noise:0.003%Vout Features:Thermal shutdown；Over Cu; Manufacturer: CJ(江苏长电/长晶); AddInBom: yes; ModelId: 78d1c457a54a48a6982859ae8b9fc42d; ModelName: SOT-89-3_L4.3-W2.5-H1.6-LS4.1-P1.50; ModelTransform: 161.417,169.291,0,180,0,0,-18.661,0,0; Voltage - Supply: 15V; Output Voltage: 3.3V; standby current: 5mA; Output Type: Fixed; Number of Outputs: 1; Symbol: CJA1117B-3.3; LCSC Part Name: 3.3V 1A 15V; SupplierPart: C24253; ManufacturerPart: CJA1117B-3.3; Supplier Footprint: SOT-89-3; JLCPCB Part Class: Extended Part; Datasheet: https://item.szlcsc.com/datasheet/CJA1117B-3.3/24993.html; Supplier: LCSC; ConvertToPcb: yes; FootprintName: SOT-89-3_L4.5-W2.5-P1.50-LS4.2-BR; Output Configuration: Positive; Output Current: 1A; Power Supply Rejection Ratio (PSRR): 75dB@(120Hz); Voltage Dropout: 1.15V@(1A); Noise: 0.003%Vout; Features: Thermal shutdown；Over Current Protection; Operating Temperature: -25℃~+125℃@(Tj)
U?#2 U?#3 U?#6 U?#7 = MCU_at32f421k8u7: CPU Core:ARM Cortex-M4 CPU Maximum Speed:120MHz Core Size:32 Bit Program Storage Size:64KB Program Memory Type:FLASH RAM Size:16KB EEPROM:- Number of I/O:27 Oscillator Type:Built-in+External Voltage - Supply:2.4V~3.6V Voltage - Supply:2.4V~3.6V Operating; Manufacturer: ARTERY(雅特力); AddInBom: yes; ModelId: 40e20aa7d2204881b0332c00d4af30de; ModelName: QFN-32_L5.0-W5.0-H0.9-P0.50; ModelTransform: 197.6374,197.6374,0,90,0,0,-0.789,-0.395,0; CPU Maximum Speed: 120MHz; Core Size: 32 Bit; Program Storage Size: 64KB; Program Memory Type: FLASH; RAM Size: 16KB; Number of I/O: 27; Symbol: AT32F421K8U7; LCSC Part Name: 基于 ARM 的 32 位 Cortex-M4 微控制器，具备闪存、定时器、ADC、比较器和通信接口; SupplierPart: C2965611; ManufacturerPart: AT32F421K8U7; Supplier Footprint: QFN-32(5x5); JLCPCB Part Class: Extended Part; Datasheet: https://item.szlcsc.com/datasheet/AT32F421K8U7/3357884.html; Supplier: LCSC; ConvertToPcb: yes; FootprintName: QFN-32_L5.0-W5.0-P0.50-BL-EP3.4; CPU Core: ARM Cortex-M4; EEPROM: -; Oscillator Type: Built-in+External; Voltage - Supply: 2.4V~3.6V; Operating Temperature: -40℃~+105℃; Features: Window watchdog (WWDG)；Independent watchdog (IWDG)；Undervoltage detection (BOR/LVD/LVR/LVI)；Calendar function；Power-on reset (POR)；Built-in general-purpose timer；Built-in temperature sensor；Hardware CRC；Infrared remote control；Integrated LDO
U?#4 U?#5 U?#8 U?#9 = GateDriver: MOS Drivers QFN-24; MF: Fortior Tech; SnapEDA_Link: https://www.snapeda.com/parts/FD6288Q/Fortior+Tech/view-part/?ref=snap; Package: Package; Value: *; MP: FD6288Q; Check_prices: https://www.snapeda.com/parts/FD6288Q/Fortior+Tech/view-part/?ref=eda